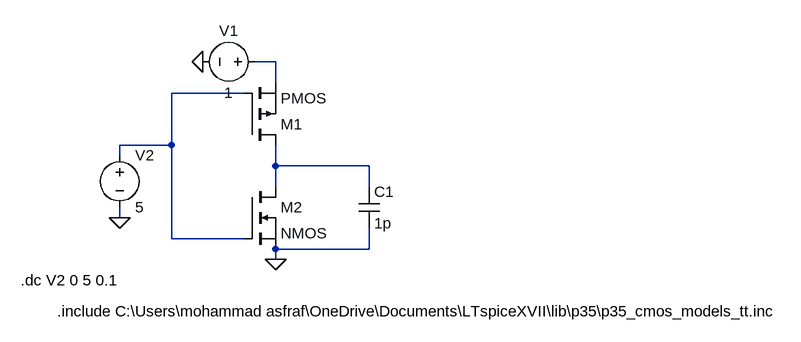
[diagram p0: schematic CMOS Inv.asc]
CMOS Inv.asc, the LTspice schematic file:
Version 4
SHEET 1 1484 1368
WIRE 224 96 192 96
WIRE 224 128 224 96
WIRE 176 144 64 144
WIRE 64 224 64 144
WIRE 64 224 -16 224
WIRE -16 240 -16 224
WIRE 224 256 224 224
WIRE 368 256 224 256
WIRE 224 288 224 256
WIRE 368 288 368 256
WIRE -16 336 -16 320
WIRE 64 368 64 224
WIRE 176 368 64 368
WIRE 368 384 368 352
WIRE 368 384 224 384
WIRE 224 400 224 384
FLAG 224 400 0
FLAG 112 96 0
FLAG -16 336 0
SYMBOL pmos 176 224 M180
SYMATTR InstName M1
SYMBOL nmos 176 288 R0
SYMATTR InstName M2
SYMBOL cap 352 288 R0
SYMATTR InstName C1
SYMATTR Value 1p
SYMBOL voltage 208 96 R90
WINDOW 0 -32 56 VBottom 2
WINDOW 3 32 56 VTop 2
WINDOW 123 0 0 Left 0
WINDOW 39 0 0 Left 0
SYMATTR InstName V1
SYMATTR Value 1
SYMBOL voltage -16 224 R0
WINDOW 123 0 0 Left 0
WINDOW 39 0 0 Left 0
SYMATTR InstName V2
SYMATTR Value 5
TEXT -168 432 Left 2 !.dc V2 0 5 0.1
TEXT -112 480 Left 2 !.include C:\\Users\\mohammad asfraf\\OneDrive\\Documents\\LTspiceXVII\\lib\\p35\\p35_cmos_models_tt.inc

The netlist it stands for:
* CMOS Inv.asc
M1 N003 N002 N001 N001 PMOS
M2 N003 N002 0 0 NMOS
C1 N003 0 1p
V1 N001 0 1
V2 N002 0 5
.model NMOS NMOS
.model PMOS PMOS
.lib standard.mos
.dc V2 0 5 0.1
.include C:\Users\mohammad asfraf\OneDrive\Documents\LTspiceXVII\lib\p35\p35_cmos_models_tt.inc
.backanno
.end